# Altium schematic sheet LPCB220 - THROTTLE CONNECTORS.SchDoc
size A3; Address1: Factory 10; Address2: 9-13 Dingley Avenue, Dandeong, VICTORIA 3175, AUSTRALIA; DocumentNumber: 16; Revision: 1; SheetNumber: 16; SheetTotal: 18; Lockie__PCB_SUB_ASSEMBLY: Throttle Connections; Lockie__PCB_ASSEMBLY: Brake Control; Lockie__LDL: LPCB220; Lockie__PCB_DESCRIPTION: Redundant Stepper Node
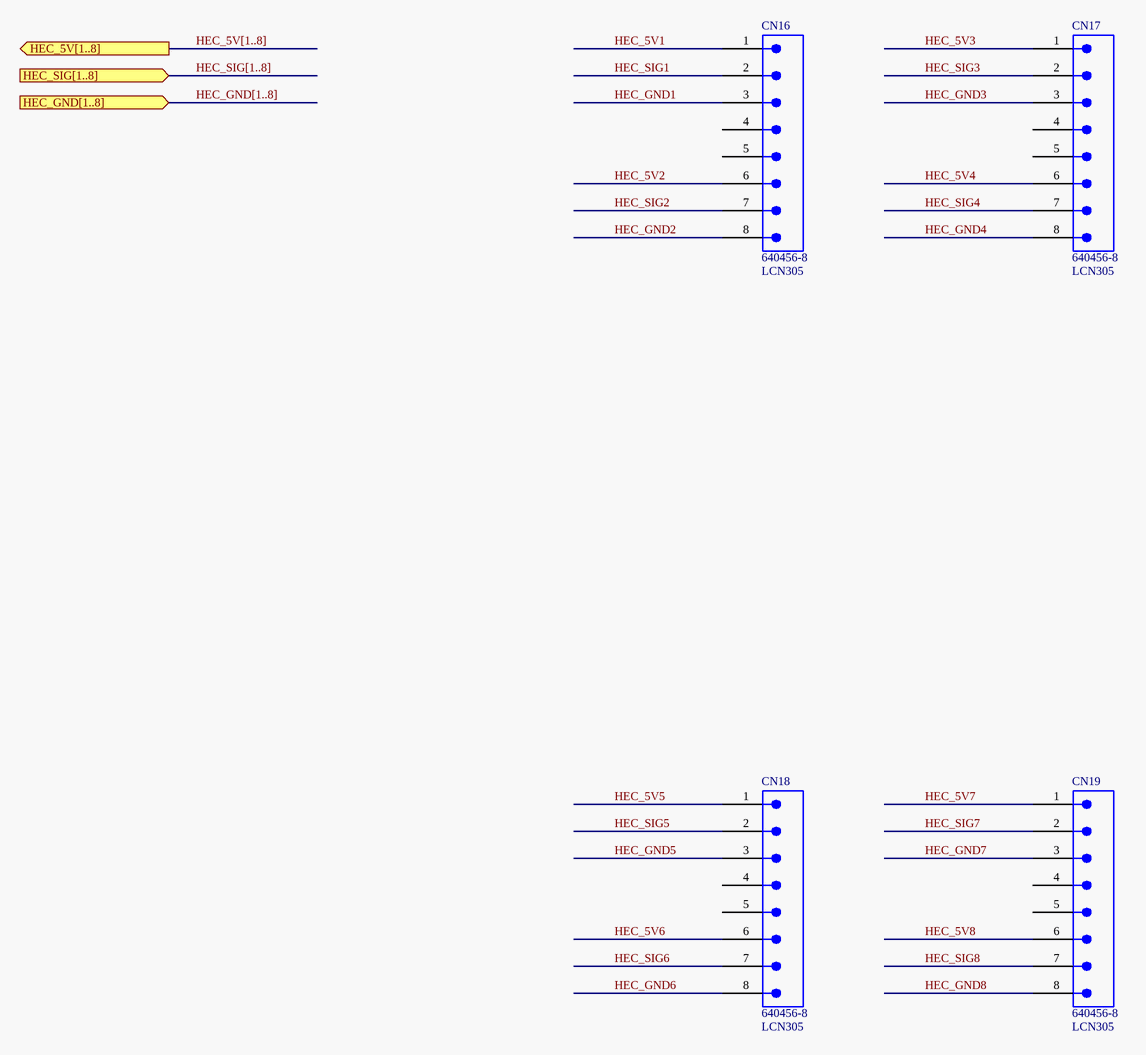
[diagram p0: LPCB220 - THROTTLE CONNECTORS.SchDoc]

## Parts
CN16  640456-8  LDL_NUMBER: LCN305  [640456-8]
CN17  640456-8  LDL_NUMBER: LCN305  [640456-8]
CN18  640456-8  LDL_NUMBER: LCN305  [640456-8]
CN19  640456-8  LDL_NUMBER: LCN305  [640456-8]

## Ports
HEC_5V[1..8] (out), HEC_GND[1..8] (in), HEC_SIG[1..8] (in)

## Nets
HEC_5V1: CN16.1
HEC_5V2: CN16.6
HEC_5V3: CN17.1
HEC_5V4: CN17.6
HEC_5V5: CN18.1
HEC_5V6: CN18.6
HEC_5V7: CN19.1
HEC_5V8: CN19.6
HEC_GND1: CN16.3
HEC_GND2: CN16.8
HEC_GND3: CN17.3
HEC_GND4: CN17.8
HEC_GND5: CN18.3
HEC_GND6: CN18.8
HEC_GND7: CN19.3
HEC_GND8: CN19.8
HEC_SIG1: CN16.2
HEC_SIG2: CN16.7
HEC_SIG3: CN17.2
HEC_SIG4: CN17.7
HEC_SIG5: CN18.2
HEC_SIG6: CN18.7
HEC_SIG7: CN19.2
HEC_SIG8: CN19.7

Not connected (* = marked no-connect by the designer): CN16 4 5; CN17 4 5; CN18 4 5; CN19 4 5

## Buses and harness runs
bus HEC_5V[1..8] = port HEC_5V[1..8]
bus HEC_GND[1..8] = port HEC_GND[1..8]
bus HEC_SIG[1..8] = port HEC_SIG[1..8]

## Notes on the sheet
- PCB COMPONENT DESCRIPTION
- LDL NUMBER
- Assembly Details
- Size
- Drawing File Name
- Revision
- http://rloop.org
- Scale
- A3
- Sheet Details
- N.T.S
- Sheet:
- Of:

## Library data of the parts
CN16-CN19 = 640456-8: Connector, Male Header, 8 Way; FMEDA__CHANNEL: COM; FMEDA__OPERATING__CURRENT_MAX: 0; FMEDA__OPERATING__TEMP_MAX: 50; FMEDA__OPERATING__TEMP_MIN: -20; FMEDA__OPERATING__TEMP_TYP: 27; FMEDA__OPERATING__VOLTAGE_MAX: 16; FMEDA__OPERATING__VOLTAGE_TYP: 12; FMEDA__FUNCTION_IN_SYSTEM: *; FMEDA__OPERATING__CURRENT_MIN: 0; FMEDA__OPERATING__CURRENT_TYP: 0; FMEDA__OPERATING__VOLTAGE_MIN: 0